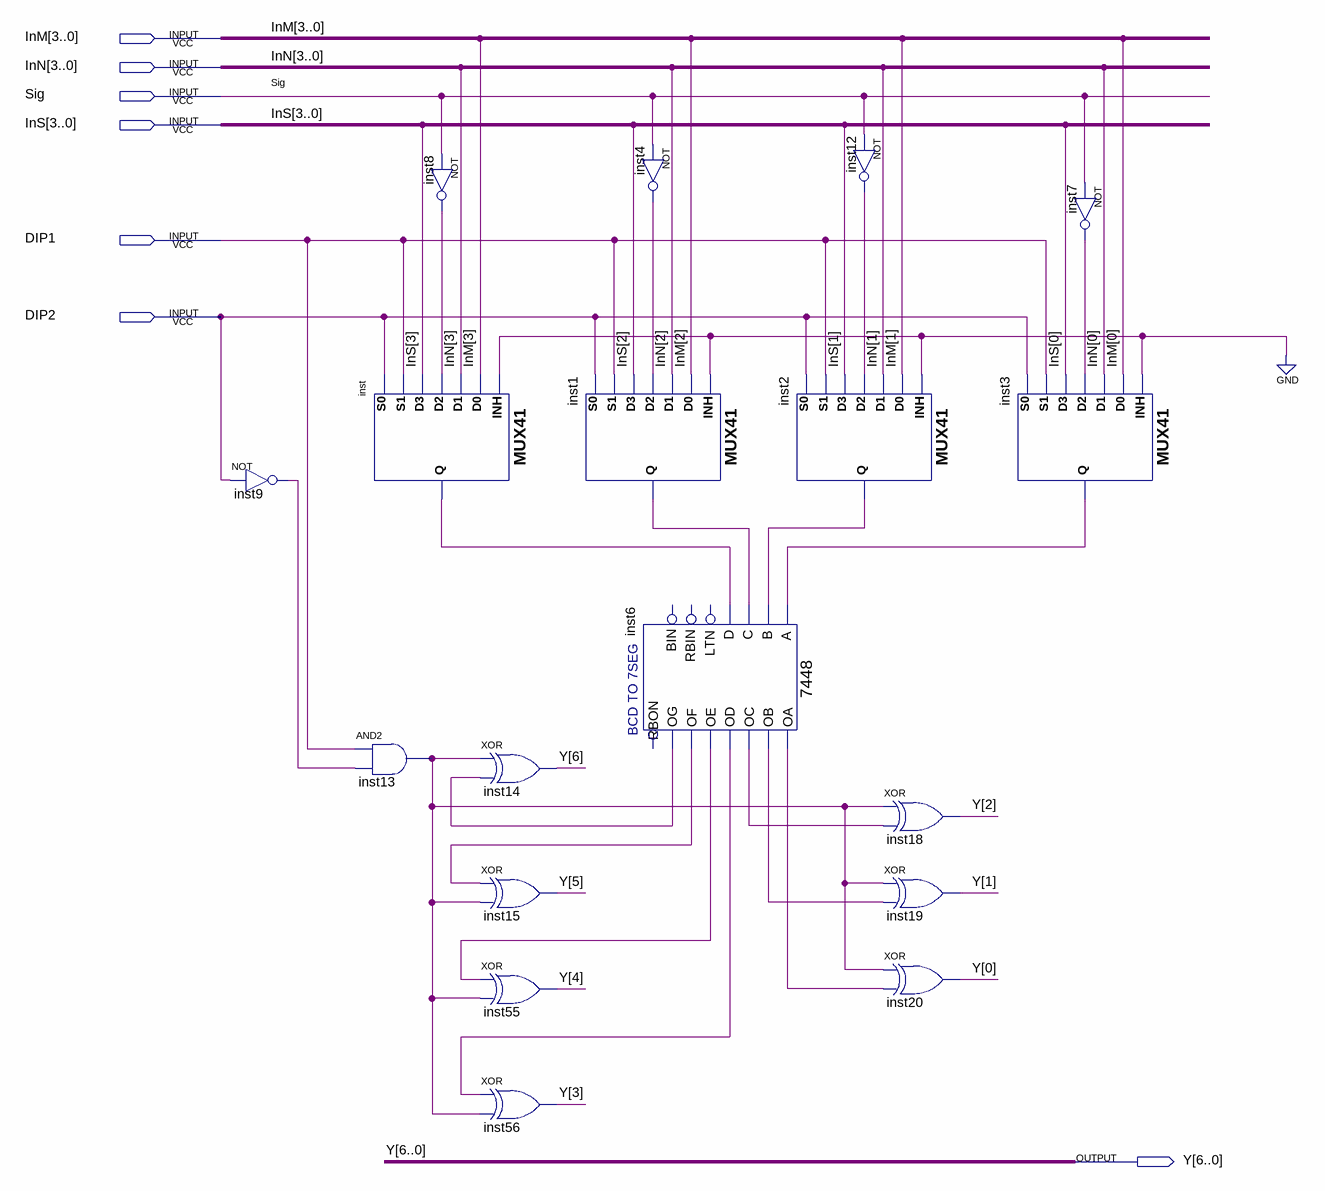
[diagram p0: schematic sheet]
// Quartus schematic DISPLAY.bdf as structural Verilog: 18 symbols, 7 pins
module DISPLAY (
  input  [3:0] InM,
  input  [3:0] InN,
  input  Sig,
  input  [3:0] InS,
  input  DIP1,
  input  DIP2,
  output [6:0] Y
);

  wire inst1_q, inst2_q, inst3_q, inst4_out, inst6_oa, inst6_ob, inst6_oc, inst6_od, inst6_oe, inst6_of,
       inst6_og, inst7_out, inst8_out, inst9_out, inst12_out, inst13_out, inst_q;

  not inst9 (inst9_out, DIP2);
  MUX41 inst (.S0(DIP2), .D2(inst8_out), .S1(DIP1), .D3(InS[3]), .D0(InM[3]), .INH(1'b0), .D1(InN[3]), .Q(inst_q));
  and inst13 (inst13_out, DIP1, inst9_out);
  not inst8 (inst8_out, Sig);
  xor inst14 (Y[6], inst13_out, inst6_og);
  xor inst15 (Y[5], inst6_of, inst13_out);
  xor inst55 (Y[4], inst6_oe, inst13_out);
  xor inst56 (Y[3], inst6_od, inst13_out);
  not inst4 (inst4_out, Sig);
  MUX41 inst1 (.S0(DIP2), .D2(inst4_out), .S1(DIP1), .D3(InS[2]), .D0(InM[2]), .INH(1'b0), .D1(InN[2]), .Q(inst1_q));
  \7448  inst6 (
    .A(inst3_q), .C(inst1_q), .D(inst_q), .B(inst2_q), .OC(inst6_oc), .OE(inst6_oe), .OD(inst6_od),
    .OF(inst6_of), .OG(inst6_og), .OB(inst6_ob), .OA(inst6_oa));  // open: RBIN, BIN, LTN, RBON
  MUX41 inst2 (.S0(DIP2), .D2(inst12_out), .S1(DIP1), .D3(InS[1]), .D0(InM[1]), .INH(1'b0), .D1(InN[1]), .Q(inst2_q));
  not inst12 (inst12_out, Sig);
  xor inst18 (Y[2], inst13_out, inst6_oc);
  xor inst19 (Y[1], inst13_out, inst6_ob);
  xor inst20 (Y[0], inst13_out, inst6_oa);
  MUX41 inst3 (.S0(DIP2), .D2(inst7_out), .S1(DIP1), .D3(InS[0]), .D0(InM[0]), .INH(1'b0), .D1(InN[0]), .Q(inst3_q));
  not inst7 (inst7_out, Sig);
endmodule
